# Altium schematic sheet k26_baseboard_reset.SchDoc: k26 Baseboard Reset / Oscillators
size A3; DrawnBy: Ch. Vogt; Organization: PBL; DocumentNumber: 1; Revision: r5; SheetNumber: 7
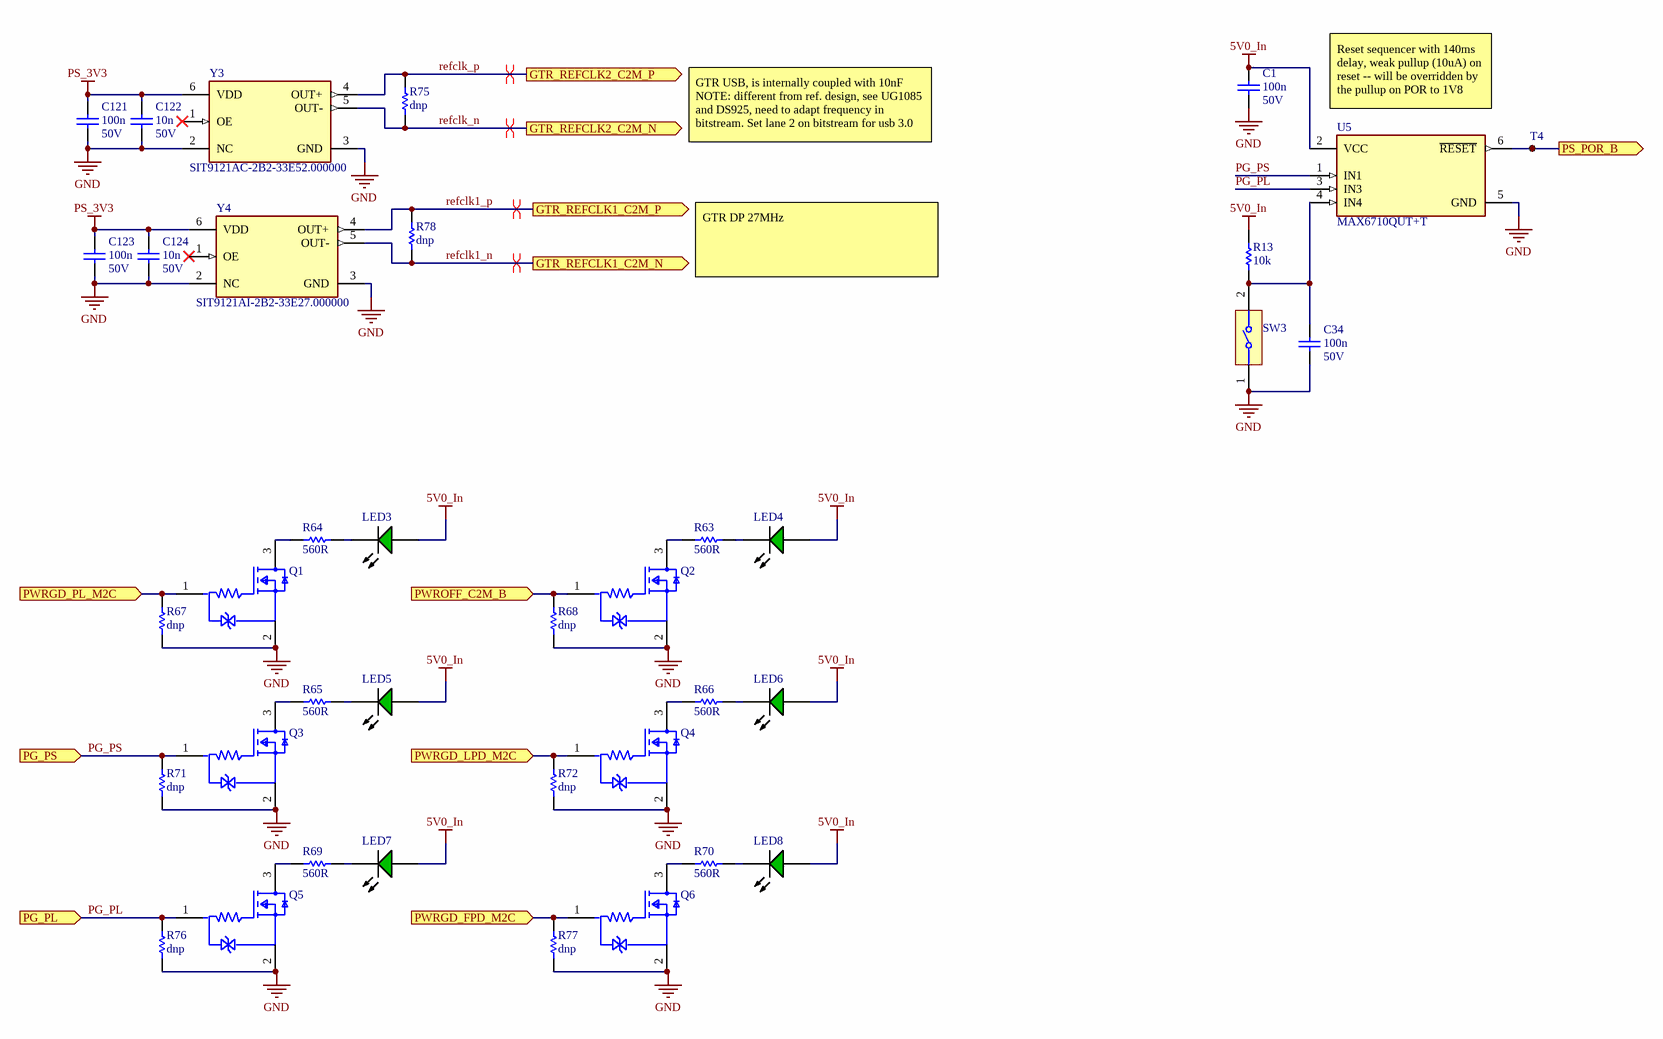
[diagram p0: k26_baseboard_reset.SchDoc]

## Parts
C1  100n  Rated DC Voltage (URdc): 50V  [CAPC0402]
C34  100n  Rated DC Voltage (URdc): 50V  [CAPC0402]
C121  100n  Rated DC Voltage (URdc): 50V  [CAPC0402]
C122  10n  Rated DC Voltage (URdc): 50V  [CAPC0402]
C123  100n  Rated DC Voltage (URdc): 50V  [CAPC0402]
C124  10n  Rated DC Voltage (URdc): 50V  [CAPC0402]
LED3  LNJ347W83RA  [LED0402(1005)_L]  (value not drawn)
LED4  LNJ347W83RA  [LED0402(1005)_L]  (value not drawn)
LED5  LNJ347W83RA  [LED0402(1005)_L]  (value not drawn)
LED6  LNJ347W83RA  [LED0402(1005)_L]  (value not drawn)
LED7  LNJ347W83RA  [LED0402(1005)_L]  (value not drawn)
LED8  LNJ347W83RA  [LED0402(1005)_L]  (value not drawn)
Q1  RUM001L02T2CL  [FP-VMT3-MFG]  (value not drawn)
Q2  RUM001L02T2CL  [FP-VMT3-MFG]  (value not drawn)
Q3  RUM001L02T2CL  [FP-VMT3-MFG]  (value not drawn)
Q4  RUM001L02T2CL  [FP-VMT3-MFG]  (value not drawn)
Q5  RUM001L02T2CL  [FP-VMT3-MFG]  (value not drawn)
Q6  RUM001L02T2CL  [FP-VMT3-MFG]  (value not drawn)
R13  10k  [RES0402]
R63  560R  [RES0402]
R64  560R  [RES0402]
R65  560R  [RES0402]
R66  560R  [RES0402]
R67  dnp  [RES0402]
R68  dnp  [RES0402]
R69  560R  [RES0402]
R70  560R  [RES0402]
R71  dnp  [RES0402]
R72  dnp  [RES0402]
R75  dnp  [RES0402]
R76  dnp  [RES0402]
R77  dnp  [RES0402]
R78  dnp  [RES0402]
SW3  KSS241GLFS  [KSS241GLFS]  (value not drawn)
T4  (no value)  [Pad-1mm]  (no BOM)
U5  MAX6710QUT+T  [FP-U6-1-MFG]
Y3  SIT9121AC-2B2-33E52.000000  [FP-SiT9121-B-MFG]
Y4  SIT9121AI-2B2-33E27.000000  [FP-SiT9121-B-MFG]

## Ports
GTR_REFCLK1_C2M_N (out), GTR_REFCLK1_C2M_P (out), GTR_REFCLK2_C2M_N (out), GTR_REFCLK2_C2M_P (out), PG_PL (in), PG_PS (in), PS_POR_B (out), PWRGD_FPD_M2C (in), PWRGD_LPD_M2C (in), PWRGD_PL_M2C (in), PWROFF_C2M_B (in)

## Nets
5V0_In: C1.2 LED3.1(A) LED4.1(A) LED5.1(A) LED6.1(A) LED7.1(A) LED8.1(A) R13.2 U5.2(VCC)
GND: C1.1 C34.1 C121.1 C122.1 C123.1 C124.1 Q1.2(Source) Q2.2(Source) Q3.2(Source) Q4.2(Source) Q5.2(Source) Q6.2(Source) R67.1 R68.1 R71.1 R72.1 R76.1 R77.1 SW3.1(T1) U5.5(GND) Y3.2(NC) Y3.3(GND) Y4.2(NC) Y4.3(GND)
PS_3V3: C121.2 C122.2 C123.2 C124.2 Y3.6(VDD) Y4.6(VDD)
PG_PL: Q5.1(Gate) R76.2 U5.3(IN3) ; port PG_PL
PG_PS: Q3.1(Gate) R71.2 U5.1(IN1) ; port PG_PS
PS_POR_B: T4.1 U5.6(~{RESET}) ; port PS_POR_B
PWRGD_FPD_M2C: Q6.1(Gate) R77.2 ; port PWRGD_FPD_M2C
PWRGD_LPD_M2C: Q4.1(Gate) R72.2 ; port PWRGD_LPD_M2C
PWRGD_PL_M2C: Q1.1(Gate) R67.2 ; port PWRGD_PL_M2C
PWROFF_C2M_B: Q2.1(Gate) R68.2 ; port PWROFF_C2M_B
refclk1_n: R78.1 Y4.5(OUT-) ; port GTR_REFCLK1_C2M_N
refclk1_p: R78.2 Y4.4(OUT+) ; port GTR_REFCLK1_C2M_P
refclk_n: R75.1 Y3.5(OUT-) ; port GTR_REFCLK2_C2M_N
refclk_p: R75.2 Y3.4(OUT+) ; port GTR_REFCLK2_C2M_P
NetC34_2: C34.2 R13.1 SW3.2(T2) U5.4(IN4)
NetLED3_2: LED3.2(K) R64.2
NetLED4_2: LED4.2(K) R63.2
NetLED5_2: LED5.2(K) R65.2
NetLED6_2: LED6.2(K) R66.2
NetLED7_2: LED7.2(K) R69.2
NetLED8_2: LED8.2(K) R70.2
NetQ1_3: Q1.3(Drain) R64.1
NetQ2_3: Q2.3(Drain) R63.1
NetQ3_3: Q3.3(Drain) R65.1
NetQ4_3: Q4.3(Drain) R66.1
NetQ5_3: Q5.3(Drain) R69.1
NetQ6_3: Q6.3(Drain) R70.1

Not connected (* = marked no-connect by the designer): Y3 1(OE)*; Y4 1(OE)*

## Layout directives
differential pair: refclk1_n, refclk1_p, refclk_n, refclk_p

## Notes on the sheet
- GTR USB, is internally coupled with 10nF
  NOTE: different from ref. design, see UG1085 and DS925, need to adapt frequency in bitstream. Set lane 2 on bitstream for usb 3.0
- Reset sequencer with 140ms delay, weak pullup (10uA) on reset -- will be overridden by the pullup on POR to 1V8
- GTR DP 27MHz
- 1
- 2
- 3
- 4
- 5
- 6
- 7
- 8
- A
- B
- C
- D
- Project:
- Date:
- Drawing number:
- Rev:
- Format:
- A3
- Drawn by:
- Laboratory:
- Page
- Sheet:
- of
- File:

## Library data of the parts
C1 C34 C121 C123 = cap0402: Ceramic Capacitor, Multilayer, Ceramic, 50V, 10% +Tol, 10% -Tol, X5R, 15% TC, 0.1uF, Surface Mount, 0402; Manufacturer: Yageo; Manufacturer Part Number: CC0402KRX5R9BB104; Capacitance: 100nF; Multilayer: Yes; Supplier 1: Farnell; Supplier Part Number 1: 3366442; RoHS: Yes; Category: Ceramic Capacitors; Stock 1: 180000; Pricing 1: 10000=0.00890, 50000=0.00870 (CHF); Mount: Surface Mount; Number of Pins: 2; Dielectric Material: Ceramic; Package Shape: Rectangular; Size Code: 0402; Terminal Finish: Nickel; Min Operating Temperature: -55°C; Max Operating Temperature: 85°C; JESD-609 Code: e3; Capacitor Type: Ceramic; Negative Tolerance: 10%; Temperature Characteristics Code: X5R; Termination: Wraparound; Positive Tolerance: 10%; Package Style: SMTMeter; Packaging: Tape and Reel; Length: 1mm; Width: 0.5mm; Height: 0.5mm; Reach SVHC Compliant: Yes; RoHS Compliant: Yes; ComponentLink1URL: https://datasheet.ciiva.com:443/pdfs/VipMasterIC/IC/YAGO/YAGO-S-A0006851646/YAGO-S-A0006851646-1.pdf?src-supplier=IHS+Markit; ComponentLink1Description: https://datasheet.ciiva.com:443/pdfs/VipMasterIC/IC/YAGO/YAGO-S-A0006851646/YAGO-S-A0006851646-1.pdf?src-supplier=IHS+Markit; ComponentLink2URL: http://www.yageo.com/documents/recent/UPY-GPHC_X5R_4V-to-50V_25.pdf?src-supplier=Digi-Key; ComponentLink2Description: http://www.yageo.com/documents/recent/UPY-GPHC_X5R_4V-to-50V_25.pdf?src-supplier=Digi-Key; ComponentLink3URL: http://www.yageo.com/documents/recent/UPY-GPHC_X5R_4V-to-50V_23.pdf?src-supplier=Digi-Key; ComponentLink3Description: http://www.yageo.com/documents/recent/UPY-GPHC_X5R_4V-to-50V_23.pdf?src-supplier=Digi-Key
C122 C124 = cap0402: Ceramic Capacitor, Multilayer, Ceramic, 50V, 10% +Tol, 10% -Tol, X7R, 15% TC, 0.01uF, Surface Mount, 0402; Manufacturer: Samsung; Manufacturer Part Number: CL05B103KB5NNNC; Value: 10nF; Multilayer: Yes; Supplier: Rs; Supplier Part Number: 7661558; RoHS: Yes; Category: Ceramic Capacitors; Stock: 350000; Pricing: 10000=0.00500, 30000=0.00400, 50000=0.00400, 100000=0.00400, 250000=0.00400 (CHF); Mounting Technology: Surface Mount; Pins: 2; Dielectric Material: Ceramic; Case/Package: 0402; Package Shape: Rectangular; Terminal Finish: Nickel; Min Operating Temperature: -55°C; Max Operating Temperature: 125°C; Capacitor Type: Ceramic; Tolerance  (fill in as +-): 10%; Tolerance (fill in as +-): 10%; Temperature Characteristics Code: X7R; Package Style: SMTMeter; Packaging: Tape and Reel; Termination: Wraparound; JESD-609 Code: e3; Length: 1mm; Width: 0.5mm; Height: 0.55mm; RoHS Compliant: Yes; Reach SVHC Compliant: Yes; ComponentLink1URL: https://datasheet.ciiva.com:443/pdfs/VipMasterIC/IC/SEMS/SEMS-S-A0008525088/SEMS-S-A0008525146-1.pdf?src-supplier=IHS+Markit; ComponentLink1Description: https://datasheet.ciiva.com:443/pdfs/VipMasterIC/IC/SEMS/SEMS-S-A0008525088/SEMS-S-A0008525146-1.pdf?src-supplier=IHS+Markit; ComponentLink2URL: https://datasheet.ciiva.com/15195/getdatasheetpartid-359682-15195636.pdf?src-supplier=Verical; ComponentLink2Description: https://datasheet.ciiva.com/15195/getdatasheetpartid-359682-15195636.pdf?src-supplier=Verical; ComponentLink3URL: https://datasheet.ciiva.com/29198/458761-da-01-en-vs-kondensator-0402-29198432.pdf?src-supplier=Conrad; ComponentLink3Description: https://datasheet.ciiva.com/29198/458761-da-01-en-vs-kondensator-0402-29198432.pdf?src-supplier=Conrad; ComponentLink4URL: https://datasheet.ciiva.com/26309/mlcc-catalogdownload2013-eng-26309005.pdf?src-supplier=Distrelec; ComponentLink4Description: https://datasheet.ciiva.com/26309/mlcc-catalogdownload2013-eng-26309005.pdf?src-supplier=Distrelec
LED3-LED8 = CMP-00397-1: Green 572nm LED Indication - Discrete 1.95V 0402 (1005 Metric); Manufacturer: Panasonic SSG; Millicandela Rating: 13mcd; Lens Style/Size: Rectangle with Flat Top, 0.70mm x 0.50mm; Current - Test: 5mA; Wavelength - Peak: 575nm; Packaging: Tape & Reel (TR); Part Status: Active; Color: Green; Lens Color: -; Lens Transparency: -; Voltage - Forward (Vf) (Typ): 1.95V; Viewing Angle: -; Mounting Type: Surface Mount; Wavelength - Dominant: 572nm; Features: -; Package / Case: 0402 (1005 Metric); Supplier Device Package: 0402 (1005 Metric); Size / Dimension: 1.00mm L x 0.50mm W; Height (Max): 0.25mm; Manufacturer Part Number: LNJ347W83RA; Supplier: Digi-Key; Supplier Part Number: LNJ347W83RACT-ND; ComponentLink1Description: LNJ347W83RA_E.pdf; ComponentLink1URL: http://www.semicon.panasonic.co.jp/ds4/LNJ347W83RA_E.pdf
Q1-Q6 = CMP-08982-000008-1: MOSFET N-CH 20V 0.1A VMT3; Manufacturer: Rohm; Threshold Vgs Min: 0.3V; Power Dissipation: 150mW; Standoff Height: 0mm; Max Forward Diode Voltage: 1.2V; Number Of N Channels: 1; Input Capacitace At Vds: 7.1pF @ 10V; Gate To Source Voltage: 8V; Pulse Drain Current: 400mA; Depletion Mode: False; Rthja Max: 833°C/W; Turn On Delay Time: 5ns; Turn Off Delay Time: 20ns; Max Junction Temp: +150°C; Threshold Vgs Max: 1V; Continuous Drain Current: 100mA; Drain To Source Resistance: 2.5Ω; Mouser Description: MOSFET; Temperature Range High: +150°C; Height: 0.55mm; Device Class L3: MOSFETs; Manufacturer Part Number: RUM001L02T2CL; Octopart: https://octopart.com/rum001l02t2cl-rohm-24403092; ComponentLink2Description: Datasheet; Drain To Source Voltage: 20V; Footprint Url: https://d1d2qsbl8m0m72.cloudfront.net/en/techdata_basic/transistor/dimension/VMT3_Dimension.pdf; Number Of Channels: 1; Device Class L1: Discrete Semiconductors; Category: Trans; Device Class L2: Transistors; Lead Free: Yes; Automotive: No; Package: VMT3; Temperature Range Low: -55°C; ComponentLink2URL: https://d1d2qsbl8m0m72.cloudfront.net/en/products/databook/datasheet/discrete/transistor/mosfet/rum001l02t2cl-e.pdf; Digikey Description: MOSFET N-CH 20V 0.1A VMT3; Drain To Source Breakdown Voltage: 20V; RoHS: TRUE; Temperature: -55°C to +150°C
R13 = res0402: Fixed Resistor, Metal Glaze/thick Film, 0.1W, 10000ohm, 50V, 1% +/-Tol, 100ppm/Cel, Surface Mount, 0402; Manufacturer: Panasonic; Manufacturer Part Number: ERJ-2RKF1002X; Power: 100mW; Rated Temperature: 70°C; Value: 10kR; Temperature Coefficient: 100ppm/°C; Package Height: 0.35mm; Package Length: 1mm; Package Width: 0.5mm; Reference Standard: AEC-Q200; Supplier: Rs; Supplier Part Number: 7325246; RoHS: Yes; Category: Chip SMD Resistors; Stock: 1630000; Pricing: 10000=0.00600, 30000=0.00500 (CHF); Mounting Technology: Surface Mount; Pins: 2; Package Shape: Rectangular; Case/Package: 0402; Terminal Finish: Nickel; Min Operating Temperature: -55°C; Max Operating Temperature: 155°C; Tolerance: 1%; JESD-609 Code: e3; Resistor Type: FIXED RESISTOR; Construction: Rectangular; Package Style: SMTMeter; Packaging: Tape and Reel; Technology: METAL GLAZE/THICK FILM; Termination: Wraparound; Working Voltage: 50V; Reach SVHC Compliant: Yes; RoHS Compliant: Yes; ComponentLink1URL: https://datasheet.ciiva.com:443/pdfs/VipMasterIC/IC/PANA/PANA-S-A0009889626/PANA-S-A0009889626-1.pdf?src-supplier=IHS+Markit; ComponentLink1Description: https://datasheet.ciiva.com:443/pdfs/VipMasterIC/IC/PANA/PANA-S-A0009889626/PANA-S-A0009889626-1.pdf?src-supplier=IHS+Markit; ComponentLink2URL: https://datasheet.ciiva.com/27055/1987020-27055643.pdf?src-supplier=Jameco; ComponentLink2Description: https://datasheet.ciiva.com/27055/1987020-27055643.pdf?src-supplier=Jameco; ComponentLink3URL: https://datasheet.ciiva.com/43467/1678782-43467402.pdf?src-supplier=Farnell; ComponentLink3Description: https://datasheet.ciiva.com/43467/1678782-43467402.pdf?src-supplier=Farnell; ComponentLink4URL: https://datasheet.ciiva.com/28514/1678782-28514185.pdf?src-supplier=Element14; ComponentLink4Description: https://datasheet.ciiva.com/28514/1678782-28514185.pdf?src-supplier=Element14; ComponentLink5URL: https://datasheet.ciiva.com/24023/aoa0000ce2-24023017.pdf?src-supplier=Mouser; ComponentLink5Description: https://datasheet.ciiva.com/24023/aoa0000ce2-24023017.pdf?src-supplier=Mouser; ComponentLink6URL: https://datasheet.ciiva.com/16782/70260748-16782590.pdf?src-supplier=Allied+Electronics; ComponentLink6Description: https://datasheet.ciiva.com/16782/70260748-16782590.pdf?src-supplier=Allied+Electronics; ComponentLink7URL: https://datasheet.ciiva.com/16786/70260748-16786734.pdf?src-supplier=Allied+Electronics; ComponentLink7Description: https://datasheet.ciiva.com/16786/70260748-16786734.pdf?src-supplier=Allied+Electronics; ComponentLink8URL: https://datasheet.ciiva.com/9194/aoa0000ce2-9194142.pdf?src-supplier=Avnet; ComponentLink8Description: https://datasheet.ciiva.com/9194/aoa0000ce2-9194142.pdf?src-supplier=Avnet; ComponentLink9URL: https://datasheet.ciiva.com/16199/aoa0000ce2-16199478.pdf?src-supplier=Future+Electronics; ComponentLink9Description: https://datasheet.ciiva.com/16199/aoa0000ce2-16199478.pdf?src-supplier=Future+Electronics; ComponentLink10URL: https://datasheet.ciiva.com/48531/aoa0000ce2-48531069.pdf?src-supplier=Avnet; ComponentLink10Description: https://datasheet.ciiva.com/48531/aoa0000ce2-48531069.pdf?src-supplier=Avnet; ComponentLink11URL: https://datasheet.ciiva.com/30201/aoa0000ce2-30201022.pdf?src-supplier=Onlinecomponents.com; ComponentLink11Description: https://datasheet.ciiva.com/30201/aoa0000ce2-30201022.pdf?src-supplier=Onlinecomponents.com
R63-R66 R69 R70 = res0402: Fixed Resistor, Metal Glaze/thick Film, 0.063W, 560ohm, 50V, 1% +/-Tol, 100ppm/Cel, Surface Mount, 0402; Manufacturer: Vishay; Manufacturer Part Number: CRCW0402560RFKED; Power: 63mW; Rated Temperature: 70°C; Temperature Coefficient: 100ppm/°C; Package Height: 0.35mm; Package Length: 1mm; Package Width: 0.5mm; Reference Standard: AEC-Q200; Supplier: Mouser; Supplier Part Number: 71-CRCW0402560RFKED; RoHS: Yes; Category: Chip SMD Resistors; Stock: 3017; Pricing: 1=0.10000, 10=0.04200, 50=0.04200, 100=0.01700, 1000=0.00800, 10000=0.00500 (USD); Mounting Technology: Surface Mount; Pins: 2; Case/Package: 0402; Package Shape: Rectangular; Terminal Finish: Nickel; Min Operating Temperature: -55°C; Max Operating Temperature: 155°C; Tolerance: 1%; Resistor Type: FIXED RESISTOR; Packaging: Tape and Reel; Value: 560R; Technology: METAL GLAZE/THICK FILM; Termination: Wraparound; Working Voltage: 50V; JESD-609 Code: e3; Construction: Chip; Package Style: SMTMeter; RoHS Compliant: Yes; Reach SVHC Compliant: Yes; ComponentLink1URL: https://datasheet.ciiva.com:443/pdfs/VipMasterIC/IC/VISH/VISH-S-A0007266705/VISH-S-A0007266705-1.pdf?src-supplier=IHS+Markit; ComponentLink1Description: https://datasheet.ciiva.com:443/pdfs/VipMasterIC/IC/VISH/VISH-S-A0007266705/VISH-S-A0007266705-1.pdf?src-supplier=IHS+Markit; ComponentLink2URL: https://datasheet.ciiva.com/11811/0900766b80d98824-11811844.pdf?src-supplier=Rs; ComponentLink2Description: https://datasheet.ciiva.com/11811/0900766b80d98824-11811844.pdf?src-supplier=Rs; ComponentLink3URL: https://datasheet.ciiva.com/16758/70201119-16758295.pdf?src-supplier=Allied+Electronics; ComponentLink3Description: https://datasheet.ciiva.com/16758/70201119-16758295.pdf?src-supplier=Allied+Electronics; ComponentLink4URL: https://datasheet.ciiva.com/2463/dcrcwe3-2463985.pdf?src-supplier=Digi-Key; ComponentLink4Description: https://datasheet.ciiva.com/2463/dcrcwe3-2463985.pdf?src-supplier=Digi-Key; ComponentLink5URL: https://datasheet.ciiva.com/2463/dcrcwe3-2463987.pdf?src-supplier=Digi-Key; ComponentLink5Description: https://datasheet.ciiva.com/2463/dcrcwe3-2463987.pdf?src-supplier=Digi-Key; ComponentLink6URL: https://datasheet.ciiva.com/2463/dcrcwe3-2463986.pdf?src-supplier=Digi-Key; ComponentLink6Description: https://datasheet.ciiva.com/2463/dcrcwe3-2463986.pdf?src-supplier=Digi-Key; ComponentLink7URL: https://datasheet.ciiva.com/8341/dcrcwe3-8341304.pdf?src-supplier=Avnet; ComponentLink7Description: https://datasheet.ciiva.com/8341/dcrcwe3-8341304.pdf?src-supplier=Avnet; ComponentLink8URL: https://datasheet.ciiva.com/16507/dcrcwe3-16507657.pdf?src-supplier=Future+Electronics; ComponentLink8Description: https://datasheet.ciiva.com/16507/dcrcwe3-16507657.pdf?src-supplier=Future+Electronics
R67 R68 R71 R72 R75-R78 = res0402: Fixed Resistor, Metal Glaze/thick Film, 0.1W, 499ohm, 50V, 1% +/-Tol, 100ppm/Cel, Surface Mount, 0402; Manufacturer: Panasonic; Manufacturer Part Number: ERJ-2RKF4990X; Rated Power Dissipation (P): 100mW; Resistance: 499R; Temperature Coefficient: 100ppm/°C; Rated Temperature: 70°C; Package Height: 0.35mm; Package Length: 1mm; Package Width: 0.5mm; Reference Standard: AEC-Q200; Supplier 1: Farnell; Supplier Part Number 1: 2692480; RoHS: Yes; Category: Chip SMD Resistors; Stock 1: 70000; Pricing 1: 10000=0.00490, 50000=0.00480, 100000=0.00470 (CHF); Mount: Surface Mount; Number of Pins: 2; Size Code: 0402; Terminal Finish: Nickel; Package Shape: Rectangular; Min Operating Temperature: -55°C; Max Operating Temperature: 155°C; Tolerance: 1%; JESD-609 Code: e3; Resistor Type: FIXED RESISTOR; Packaging: Tape and Reel; Technology: METAL GLAZE/THICK FILM; Working Voltage: 50V; Construction: Rectangular; Package Style: SMTMeter; Termination: Wraparound; Reach SVHC Compliant: Yes; RoHS Compliant: Yes; ComponentLink1URL: https://datasheet.ciiva.com:443/pdfs/VipMasterIC/IC/PANA/PANA-S-A0009889626/PANA-S-A0009889626-1.pdf?src-supplier=IHS+Markit; ComponentLink1Description: https://datasheet.ciiva.com:443/pdfs/VipMasterIC/IC/PANA/PANA-S-A0009889626/PANA-S-A0009889626-1.pdf?src-supplier=IHS+Markit; ComponentLink2URL: https://datasheet.ciiva.com/6201/426256-6201373.pdf?src-supplier=Farnell; ComponentLink2Description: https://datasheet.ciiva.com/6201/426256-6201373.pdf?src-supplier=Farnell; ComponentLink3URL: https://datasheet.ciiva.com/46377/426256-46377550.pdf?src-supplier=Element14; ComponentLink3Description: https://datasheet.ciiva.com/46377/426256-46377550.pdf?src-supplier=Element14; ComponentLink4URL: https://datasheet.ciiva.com/22749/1678782-22749610.pdf?src-supplier=Element14; ComponentLink4Description: https://datasheet.ciiva.com/22749/1678782-22749610.pdf?src-supplier=Element14; ComponentLink5URL: https://datasheet.ciiva.com/28695/1678782-28695781.pdf?src-supplier=Element14; ComponentLink5Description: https://datasheet.ciiva.com/28695/1678782-28695781.pdf?src-supplier=Element14; ComponentLink6URL: https://datasheet.ciiva.com/16766/70260748-16766015.pdf?src-supplier=Allied+Electronics; ComponentLink6Description: https://datasheet.ciiva.com/16766/70260748-16766015.pdf?src-supplier=Allied+Electronics; ComponentLink7URL: https://datasheet.ciiva.com/16765/70260748-16765054.pdf?src-supplier=Allied+Electronics; ComponentLink7Description: https://datasheet.ciiva.com/16765/70260748-16765054.pdf?src-supplier=Allied+Electronics; ComponentLink8URL: https://datasheet.ciiva.com/9181/aoa0000ce2-9181461.pdf?src-supplier=Avnet; ComponentLink8Description: https://datasheet.ciiva.com/9181/aoa0000ce2-9181461.pdf?src-supplier=Avnet; ComponentLink9URL: https://datasheet.ciiva.com/16508/aoa0000ce2-16508382.pdf?src-supplier=Future+Electronics; ComponentLink9Description: https://datasheet.ciiva.com/16508/aoa0000ce2-16508382.pdf?src-supplier=Future+Electronics
SW3 = CMP-00077-3: SWITCH TACTILE SPST-NO 0.05A 50V; Manufacturer: C&K Components; Illumination: Non-Illuminated; Operating Force: 400gf; Switch Travel: 0.30mm; Outline: 7.00mm x 3.50mm; Ingress Protection: IP40; Switch Function: Off-Mom; Contact Rating @ Voltage: 0.05A @ 50VDC; Mechanical Life: 100,000 Cycles; Actuator Type: Rectangular Button; Actuator Orientation: Side Actuated; Illumination Type, Color: -; Features: Tactile Feedback; Circuit: SPST-NO; Supplier: Digi-Key; Supplier Part Number: 401-1099-2-ND; P/N: KSS241GLFS; Mounting Type: Surface Mount, Right Angle; Illumination Voltage (Nominal): -; ComponentLink1URL: http://www.ck-components.com/14403/kss.pdf/; Termination Style: Gull Wing; Actuator Material: -; Actuator Height off PCB, from Pins: -; Packaging: Tape & Reel (TR); Operating Temperature: -40°C ~ 85°C
T4 = CMP-01283-1: 1mm SMT Test Pad; Mounting Technology: SMT
U5 = CMP-05723-001675-1: IC SUPERVISOR 4 CHANNEL SOT23-6; Reset Timeout: 140ms; Reset: Active Low; Max Power Dissipation: 695.7mW; Threshold Voltage: 4.63V; Min Supply Voltage: 2V; Watchdog Timer: No; Number of Voltages Monitored: 4; Max Supply Voltage: 5.5V; Operating Supply Current: 35uA; Min Operating Temperature: -40°C; Lead Free: Lead Free; Type: Multi-Voltage Supervisor; Max Operating Temperature: 85°C; Mount: Surface Mount; RoHS Compliant: Yes; Number of Pins: 6; Packaging: Tape and Reel; Case/Package: SOT-23-6; Package Quantity: 1; Radiation Hardening: No; Series: -
Y3 Y4 = CMP-25159-261142-1: MEMS OSC XO 52.0000MHZ LVDS SMD; Manufacturer: SiTime; Manufacturer Part Number: SIT9121AC-2B2-33E100.000000